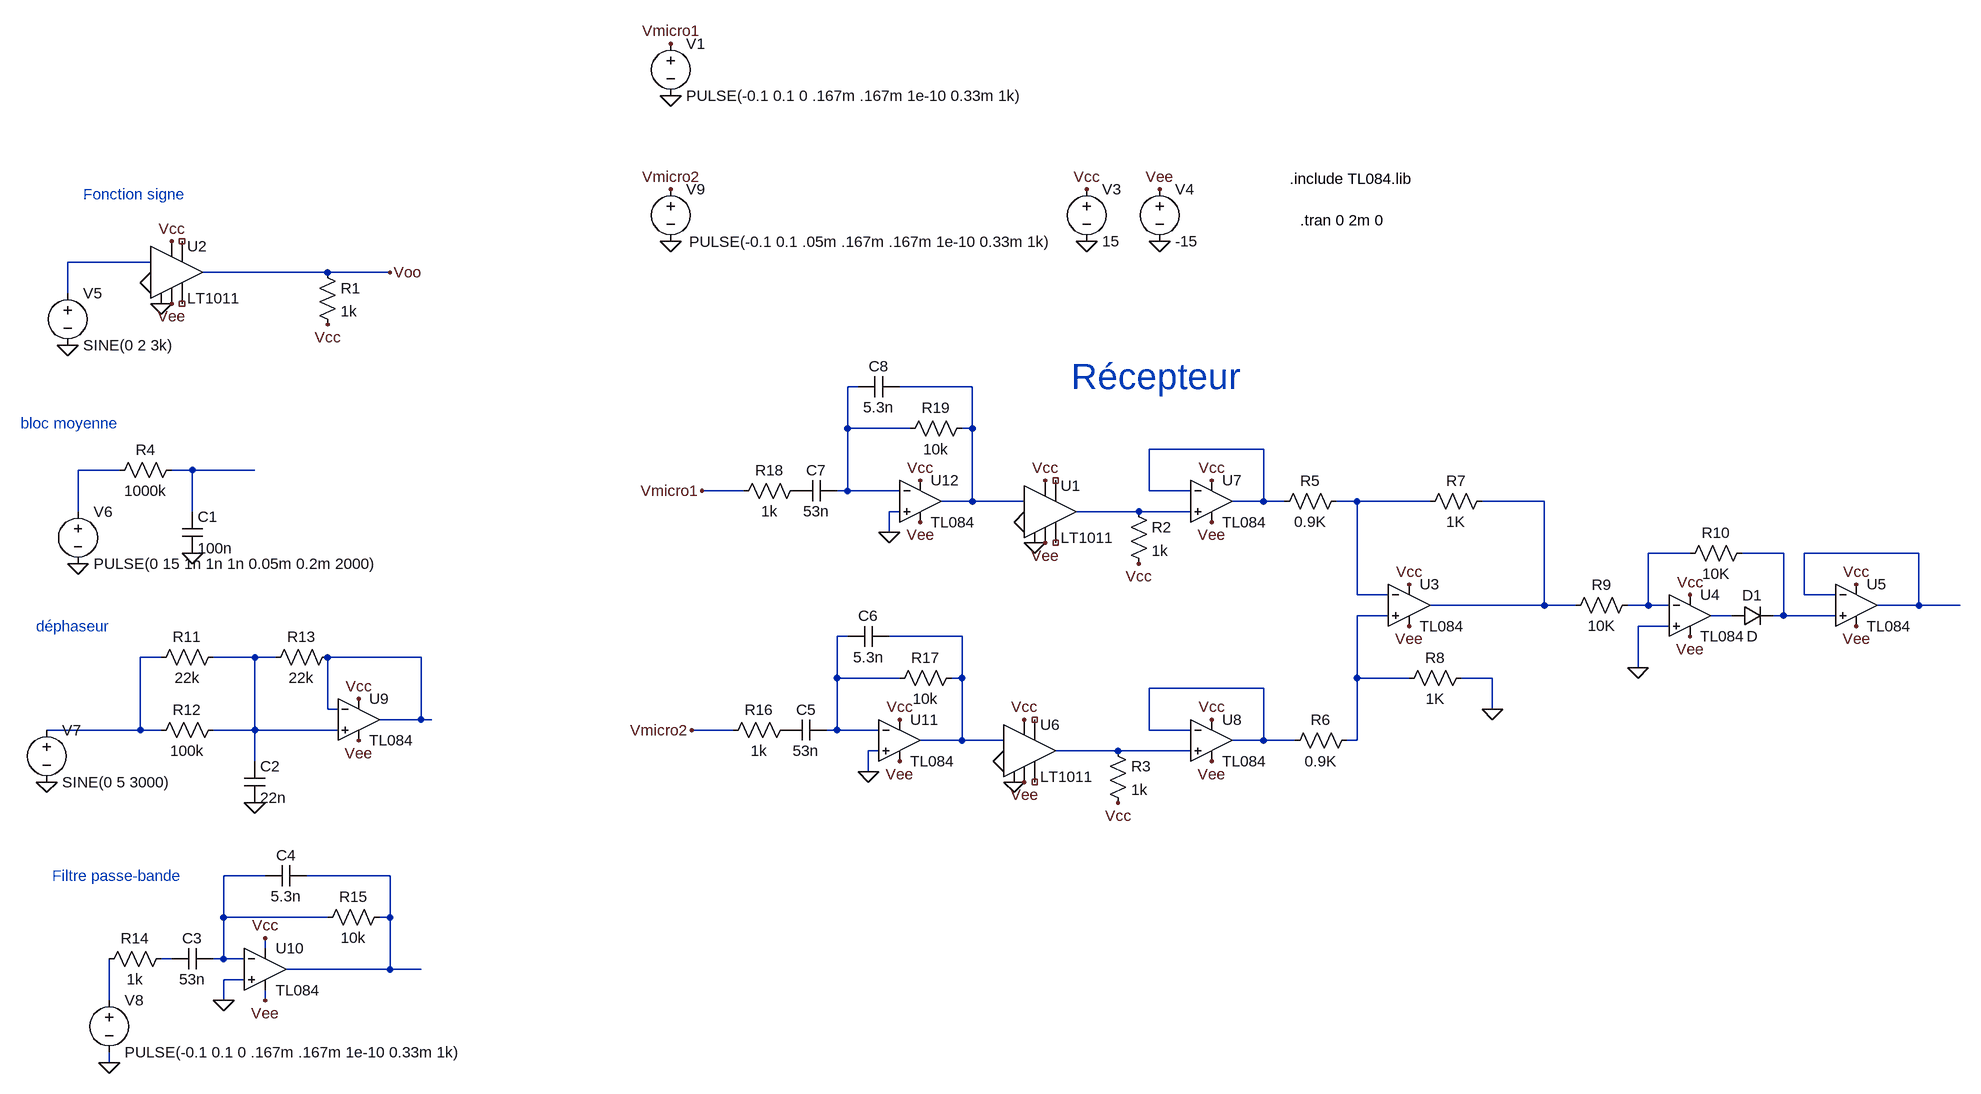
[diagram p0: schematic bloc_recepteur.asc]
bloc_recepteur.asc, the LTspice schematic file:
Version 4
SHEET 1 1812 816
WIRE -976 -432 -1104 -432
WIRE -704 -416 -896 -416
WIRE -608 -416 -704 -416
WIRE -1104 -384 -1104 -432
WIRE 112 -240 96 -240
WIRE 288 -240 176 -240
WIRE 96 -176 96 -240
WIRE 192 -176 96 -176
WIRE 288 -176 288 -240
WIRE 288 -176 272 -176
WIRE 736 -144 560 -144
WIRE -1024 -112 -1088 -112
WIRE -912 -112 -944 -112
WIRE -816 -112 -912 -112
WIRE -64 -80 -128 -80
WIRE 96 -80 96 -176
WIRE 96 -80 80 -80
WIRE 176 -80 96 -80
WIRE 560 -80 560 -144
WIRE 624 -80 560 -80
WIRE 288 -64 288 -176
WIRE 288 -64 240 -64
WIRE 368 -64 288 -64
WIRE 736 -64 736 -144
WIRE 736 -64 688 -64
WIRE 768 -64 736 -64
WIRE 880 -64 848 -64
WIRE 992 -64 880 -64
WIRE 1168 -64 1072 -64
WIRE -1088 -48 -1088 -112
WIRE -912 -48 -912 -112
WIRE 176 -48 160 -48
WIRE 544 -48 448 -48
WIRE 624 -48 544 -48
WIRE 160 -16 160 -48
WIRE 1392 16 1328 16
WIRE 1536 16 1472 16
WIRE 1744 16 1568 16
WIRE 880 80 880 -64
WIRE 928 80 880 80
WIRE 1568 80 1568 16
WIRE 1616 80 1568 80
WIRE 1168 96 1168 -64
WIRE 1168 96 992 96
WIRE 1216 96 1168 96
WIRE 1328 96 1328 16
WIRE 1328 96 1296 96
WIRE 1360 96 1328 96
WIRE 1744 96 1744 16
WIRE 1744 96 1680 96
WIRE 1808 96 1744 96
WIRE 928 112 880 112
WIRE 1456 112 1424 112
WIRE 1536 112 1536 16
WIRE 1536 112 1520 112
WIRE 1616 112 1536 112
WIRE 1360 128 1312 128
WIRE 96 144 80 144
WIRE 272 144 160 144
WIRE -960 176 -992 176
WIRE -816 176 -880 176
WIRE -784 176 -816 176
WIRE -560 176 -704 176
WIRE 1312 192 1312 128
WIRE 80 208 80 144
WIRE 176 208 80 208
WIRE 272 208 272 144
WIRE 272 208 256 208
WIRE 880 208 880 112
WIRE 960 208 880 208
WIRE 1088 208 1040 208
WIRE 736 224 560 224
WIRE -704 256 -704 176
WIRE -688 256 -704 256
WIRE 1088 256 1088 208
WIRE -560 272 -560 176
WIRE -560 272 -624 272
WIRE -544 272 -560 272
WIRE -992 288 -992 176
WIRE -992 288 -1136 288
WIRE -960 288 -992 288
WIRE -816 288 -816 176
WIRE -816 288 -880 288
WIRE -688 288 -816 288
WIRE -80 288 -144 288
WIRE 80 288 80 208
WIRE 80 288 64 288
WIRE 144 288 80 288
WIRE 560 288 560 224
WIRE 624 288 560 288
WIRE 272 304 272 208
WIRE 272 304 208 304
WIRE 336 304 272 304
WIRE 736 304 736 224
WIRE 736 304 688 304
WIRE 784 304 736 304
WIRE 880 304 880 208
WIRE 880 304 864 304
WIRE 144 320 128 320
WIRE 512 320 416 320
WIRE 624 320 512 320
WIRE -816 336 -816 288
WIRE 128 352 128 320
WIRE -800 512 -864 512
WIRE -608 512 -736 512
WIRE -864 576 -864 512
WIRE -704 576 -864 576
WIRE -608 576 -608 512
WIRE -608 576 -624 576
WIRE -800 624 -800 608
WIRE -944 640 -960 640
WIRE -864 640 -864 576
WIRE -864 640 -880 640
WIRE -832 640 -864 640
WIRE -608 656 -608 576
WIRE -608 656 -768 656
WIRE -560 656 -608 656
WIRE -832 672 -864 672
WIRE -1040 704 -1040 640
WIRE -864 704 -864 672
WIRE -800 704 -800 688
WIRE -1040 800 -1040 784
FLAG 464 -464 0
FLAG 576 -464 0
FLAG 464 -544 Vcc
FLAG 576 -544 Vee
FLAG 960 64 Vcc
FLAG 960 128 Vee
FLAG 1088 256 0
FLAG 1312 192 0
FLAG 1648 64 Vcc
FLAG 1392 80 Vcc
FLAG 1648 128 Vee
FLAG 1392 144 Vee
FLAG -944 -464 Vcc
FLAG -944 -368 Vee
FLAG -1104 -304 0
FLAG -976 -400 0
FLAG -960 -368 0
FLAG -608 -416 Voo
FLAG -704 -336 Vcc
FLAG 400 -96 Vcc
FLAG 400 0 Vee
FLAG 368 -32 0
FLAG 384 0 0
FLAG 544 32 Vcc
FLAG 368 272 Vcc
FLAG 368 368 Vee
FLAG 336 336 0
FLAG 352 368 0
FLAG 512 400 Vcc
FLAG 656 -96 Vcc
FLAG 656 -32 Vee
FLAG 656 272 Vcc
FLAG 656 336 Vee
FLAG -1088 32 0
FLAG -912 16 0
FLAG -656 240 Vcc
FLAG -656 304 Vee
FLAG -816 400 0
FLAG -1136 368 0
FLAG -800 704 Vee
FLAG -800 608 Vcc
FLAG -1040 800 0
FLAG -864 704 0
FLAG 160 -16 0
FLAG 128 352 0
FLAG 176 336 Vee
FLAG 208 -32 Vee
FLAG 176 272 Vcc
FLAG 208 -96 Vcc
FLAG -176 -464 0
FLAG -176 -544 Vmicro2
FLAG -128 -80 Vmicro1
FLAG -144 288 Vmicro2
FLAG -176 -688 0
FLAG -176 -768 Vmicro1
SYMBOL voltage 464 -560 R0
WINDOW 123 0 0 Left 0
WINDOW 39 0 0 Left 0
SYMATTR InstName V3
SYMATTR Value 15
SYMBOL voltage 576 -560 R0
WINDOW 123 0 0 Left 0
WINDOW 39 0 0 Left 0
SYMATTR InstName V4
SYMATTR Value -15
SYMBOL opamp2 960 32 R0
SYMATTR InstName U3
SYMATTR Value TL084
SYMBOL res 864 -80 R90
WINDOW 0 0 56 VBottom 2
WINDOW 3 32 56 VTop 2
SYMATTR InstName R5
SYMATTR Value 0.9K
SYMBOL res 880 288 R90
WINDOW 0 0 56 VBottom 2
WINDOW 3 32 56 VTop 2
SYMATTR InstName R6
SYMATTR Value 0.9K
SYMBOL res 1088 -80 R90
WINDOW 0 0 56 VBottom 2
WINDOW 3 32 56 VTop 2
SYMATTR InstName R7
SYMATTR Value 1K
SYMBOL res 1056 192 R90
WINDOW 0 0 56 VBottom 2
WINDOW 3 32 56 VTop 2
SYMATTR InstName R8
SYMATTR Value 1K
SYMBOL res 1312 80 R90
WINDOW 0 0 56 VBottom 2
WINDOW 3 32 56 VTop 2
SYMATTR InstName R9
SYMATTR Value 10K
SYMBOL opamp2 1392 48 R0
SYMATTR InstName U4
SYMATTR Value TL084
SYMBOL res 1488 0 R90
WINDOW 0 0 56 VBottom 2
WINDOW 3 32 56 VTop 2
SYMATTR InstName R10
SYMATTR Value 10K
SYMBOL diode 1456 128 R270
WINDOW 0 32 32 VTop 2
WINDOW 3 0 32 VBottom 2
SYMATTR InstName D1
SYMBOL opamp2 1648 32 R0
SYMATTR InstName U5
SYMATTR Value TL084
SYMBOL LT1011 -944 -416 R0
SYMATTR InstName U2
SYMBOL voltage -1104 -400 R0
WINDOW 123 0 0 Left 0
WINDOW 39 0 0 Left 0
SYMATTR InstName V5
SYMATTR Value SINE(0 2 3k)
SYMBOL res -720 -432 R0
SYMATTR InstName R1
SYMATTR Value 1k
SYMBOL LT1011 400 -48 R0
SYMATTR InstName U1
SYMBOL res 528 -64 R0
SYMATTR InstName R2
SYMATTR Value 1k
SYMBOL LT1011 368 320 R0
SYMATTR InstName U6
SYMBOL res 496 304 R0
SYMATTR InstName R3
SYMATTR Value 1k
SYMBOL opamp2 656 -128 R0
SYMATTR InstName U7
SYMATTR Value TL084
SYMBOL opamp2 656 240 R0
SYMATTR InstName U8
SYMATTR Value TL084
SYMBOL voltage -1088 -64 R0
WINDOW 123 0 0 Left 0
WINDOW 39 0 0 Left 0
SYMATTR InstName V6
SYMATTR Value PULSE(0 15 1n 1n 1n 0.05m 0.2m 2000)
SYMBOL res -928 -128 R90
WINDOW 0 0 56 VBottom 2
WINDOW 3 32 56 VTop 2
SYMATTR InstName R4
SYMATTR Value 1000k
SYMBOL cap -928 -48 R0
SYMATTR InstName C1
SYMATTR Value 100n
SYMBOL voltage -1136 272 R0
WINDOW 123 0 0 Left 0
WINDOW 39 0 0 Left 0
SYMATTR InstName V7
SYMATTR Value SINE(0 5 3000)
SYMBOL res -864 160 R90
WINDOW 0 0 56 VBottom 2
WINDOW 3 32 56 VTop 2
SYMATTR InstName R11
SYMATTR Value 22k
SYMBOL res -864 272 R90
WINDOW 0 0 56 VBottom 2
WINDOW 3 32 56 VTop 2
SYMATTR InstName R12
SYMATTR Value 100k
SYMBOL res -688 160 R90
WINDOW 0 0 56 VBottom 2
WINDOW 3 32 56 VTop 2
SYMATTR InstName R13
SYMATTR Value 22k
SYMBOL cap -832 336 R0
SYMATTR InstName C2
SYMATTR Value 22n
SYMBOL opamp2 -656 208 R0
SYMATTR InstName U9
SYMATTR Value TL084
SYMBOL Opamps/opamp2 -800 592 R0
SYMATTR InstName U10
SYMATTR Value TL084
SYMBOL voltage -1040 688 R0
SYMATTR InstName V8
SYMATTR Value PULSE(-0.1 0.1 0 .167m .167m 1e-10 0.33m 1k)
SYMBOL res -944 624 R90
WINDOW 0 0 56 VBottom 2
WINDOW 3 32 56 VTop 2
SYMATTR InstName R14
SYMATTR Value 1k
SYMBOL res -608 560 R90
WINDOW 0 0 56 VBottom 2
WINDOW 3 32 56 VTop 2
SYMATTR InstName R15
SYMATTR Value 10k
SYMBOL cap -880 624 R90
WINDOW 0 0 32 VBottom 2
WINDOW 3 32 32 VTop 2
SYMATTR InstName C3
SYMATTR Value 53n
SYMBOL cap -736 496 R90
WINDOW 0 0 32 VBottom 2
WINDOW 3 32 32 VTop 2
SYMATTR InstName C4
SYMATTR Value 5.3n
SYMBOL Opamps/opamp2 176 240 R0
SYMATTR InstName U11
SYMATTR Value TL084
SYMBOL Opamps/opamp2 208 -128 R0
SYMATTR InstName U12
SYMATTR Value TL084
SYMBOL res 16 272 R90
WINDOW 0 0 56 VBottom 2
WINDOW 3 32 56 VTop 2
SYMATTR InstName R16
SYMATTR Value 1k
SYMBOL res 272 192 R90
WINDOW 0 0 56 VBottom 2
WINDOW 3 32 56 VTop 2
SYMATTR InstName R17
SYMATTR Value 10k
SYMBOL res 32 -96 R90
WINDOW 0 0 56 VBottom 2
WINDOW 3 32 56 VTop 2
SYMATTR InstName R18
SYMATTR Value 1k
SYMBOL res 288 -192 R90
WINDOW 0 0 56 VBottom 2
WINDOW 3 32 56 VTop 2
SYMATTR InstName R19
SYMATTR Value 10k
SYMBOL cap 64 272 R90
WINDOW 0 0 32 VBottom 2
WINDOW 3 32 32 VTop 2
SYMATTR InstName C5
SYMATTR Value 53n
SYMBOL cap 160 128 R90
WINDOW 0 0 32 VBottom 2
WINDOW 3 32 32 VTop 2
SYMATTR InstName C6
SYMATTR Value 5.3n
SYMBOL cap 80 -96 R90
WINDOW 0 0 32 VBottom 2
WINDOW 3 32 32 VTop 2
SYMATTR InstName C7
SYMATTR Value 53n
SYMBOL cap 176 -256 R90
WINDOW 0 0 32 VBottom 2
WINDOW 3 32 32 VTop 2
SYMATTR InstName C8
SYMATTR Value 5.3n
SYMBOL voltage -176 -560 R0
WINDOW 3 28 97 Left 2
SYMATTR InstName V9
SYMATTR Value PULSE(-0.1 0.1 .05m .167m .167m 1e-10 0.33m 1k)
SYMBOL voltage -176 -784 R0
SYMATTR InstName V1
SYMATTR Value PULSE(-0.1 0.1 0 .167m .167m 1e-10 0.33m 1k)
TEXT 776 -560 Left 2 !.include TL084.lib
TEXT 792 -496 Left 2 !.tran 0 2m 0
TEXT -1080 -536 Left 2 ;Fonction signe
TEXT -1176 -184 Left 2 ;bloc moyenne
TEXT -1152 128 Left 2 ;déphaseur
TEXT 440 -256 Left 5 ;Récepteur
TEXT -1128 512 Left 2 ;Filtre passe-bande

The netlist it stands for:
* bloc_recepteur.asc
V3 Vcc 0 15
V4 Vee 0 -15
XU3 N013 N007 Vcc Vee N008 TL084  ; pins In+ In- V+ V- OUT
R5 N007 N004 0.9K
R6 N013 N020 0.9K
R7 N008 N007 1K
R8 0 N013 1K
R9 N010 N008 10K
XU4 0 N010 Vcc Vee N014 TL084  ; pins In+ In- V+ V- OUT
R10 N011 N010 10K
D1 N014 N011 D
XU5 N011 N012 Vcc Vee N012 TL084  ; pins In+ In- V+ V- OUT
XU2 0 0 N001 Vee NC_01 NC_02 Voo Vcc LT1011
V5 N001 0 SINE(0 2 3k)
R1 Voo Vcc 1k
XU1 0 0 N003 Vee NC_03 NC_04 N009 Vcc LT1011
R2 N009 Vcc 1k
XU6 0 0 N016 Vee NC_05 NC_06 N021 Vcc LT1011
R3 N021 Vcc 1k
XU7 N009 N004 Vcc Vee N004 TL084  ; pins In+ In- V+ V- OUT
XU8 N021 N020 Vcc Vee N020 TL084  ; pins In+ In- V+ V- OUT
V6 N005 0 PULSE(0 15 1n 1n 1n 0.05m 0.2m 2000)
R4 N006 N005 1000k
C1 N006 0 100n
V7 N017 0 SINE(0 5 3000)
R11 N018 N017 22k
R12 N018 N017 100k
R13 N019 N018 22k
C2 N018 0 22n
XU9 N018 N019 Vcc Vee N019 TL084  ; pins In+ In- V+ V- OUT
XU10 0 N022 Vcc Vee N023 TL084  ; pins In+ In- V+ V- OUT
V8 N025 0 PULSE(-0.1 0.1 0 .167m .167m 1e-10 0.33m 1k)
R14 N024 N025 1k
R15 N023 N022 10k
C3 N022 N024 53n
C4 N023 N022 5.3n
XU11 0 N015 Vcc Vee N016 TL084  ; pins In+ In- V+ V- OUT
XU12 0 N002 Vcc Vee N003 TL084  ; pins In+ In- V+ V- OUT
R16 P001 Vmicro2 1k
R17 N016 N015 10k
R18 P002 Vmicro1 1k
R19 N003 N002 10k
C5 N015 P001 53n
C6 N016 N015 5.3n
C7 N002 P002 53n
C8 N003 N002 5.3n
V9 Vmicro2 0 PULSE(-0.1 0.1 .05m .167m .167m 1e-10 0.33m 1k)
V1 Vmicro1 0 PULSE(-0.1 0.1 0 .167m .167m 1e-10 0.33m 1k)
.model D D
.lib standard.dio
.include TL084.lib
.tran 0 2m 0
* Fonction signe
* bloc moyenne
* déphaseur
* Récepteur
* Filtre passe-bande
.lib LTC1.lib
.backanno
.end